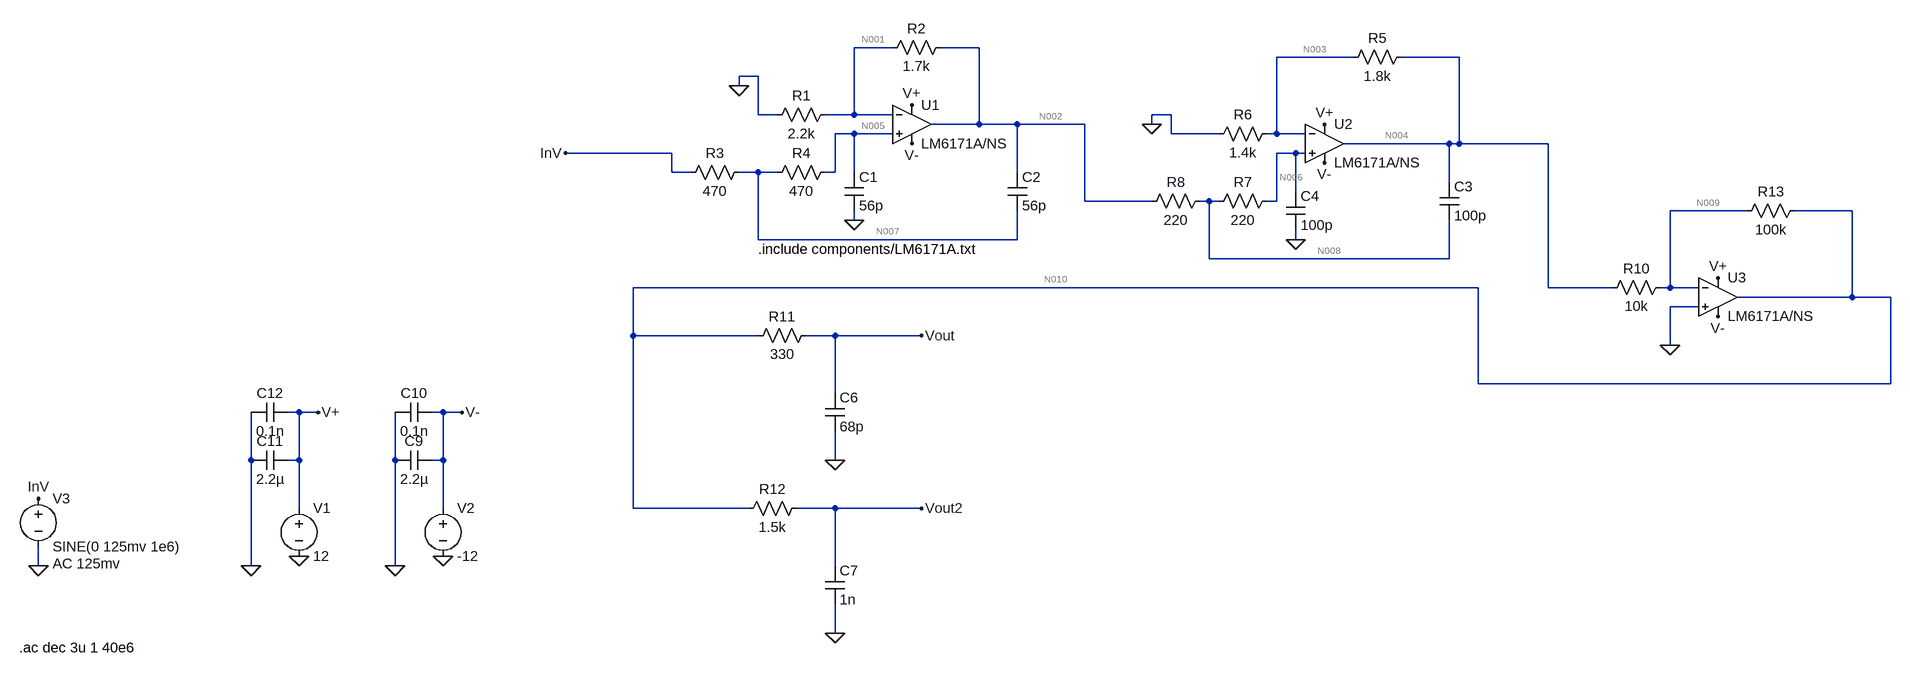
[diagram p0: schematic stage-4-LM318-sullen-key - only.asc]
stage-4-LM318-sullen-key - only.asc, the LTspice schematic file:
Version 4
SHEET 1 1972 1252
WIRE 176 32 112 32
WIRE 320 32 256 32
WIRE 944 48 816 48
WIRE 1120 48 1024 48
WIRE -48 80 -80 80
WIRE -80 96 -80 80
WIRE -48 144 -48 80
WIRE -16 144 -48 144
WIRE 112 144 112 32
WIRE 112 144 64 144
WIRE 176 144 112 144
WIRE 640 144 608 144
WIRE 320 160 320 32
WIRE 320 160 240 160
WIRE 384 160 320 160
WIRE 496 160 384 160
WIRE 608 160 608 144
WIRE 112 176 80 176
WIRE 176 176 112 176
WIRE 640 176 640 144
WIRE 720 176 640 176
WIRE 816 176 816 48
WIRE 816 176 800 176
WIRE 864 176 816 176
WIRE 1104 192 928 192
WIRE 1120 192 1120 48
WIRE 1120 192 1104 192
WIRE 1280 192 1120 192
WIRE -192 208 -464 208
WIRE 848 208 816 208
WIRE 864 208 848 208
WIRE -192 240 -192 208
WIRE -160 240 -192 240
WIRE -48 240 -80 240
WIRE -16 240 -48 240
WIRE 80 240 80 176
WIRE 80 240 64 240
WIRE 112 240 112 176
WIRE 384 240 384 160
WIRE 1104 256 1104 192
WIRE 848 272 848 208
WIRE 496 288 496 160
WIRE 608 288 496 288
WIRE 704 288 688 288
WIRE 720 288 704 288
WIRE 816 288 816 208
WIRE 816 288 800 288
WIRE 1648 304 1520 304
WIRE 1824 304 1728 304
WIRE 112 320 112 304
WIRE -48 352 -48 240
WIRE 384 352 384 304
WIRE 384 352 -48 352
WIRE 848 352 848 336
WIRE 704 384 704 288
WIRE 1104 384 1104 320
WIRE 1104 384 704 384
WIRE 1152 432 -256 432
WIRE 1280 432 1280 192
WIRE 1424 432 1280 432
WIRE 1520 432 1520 304
WIRE 1520 432 1504 432
WIRE 1568 432 1520 432
WIRE 1824 448 1824 304
WIRE 1824 448 1632 448
WIRE 1888 448 1824 448
WIRE 1568 464 1520 464
WIRE -256 512 -256 432
WIRE -48 512 -256 512
WIRE 80 512 32 512
WIRE 224 512 80 512
WIRE 1520 528 1520 464
WIRE 1152 592 1152 432
WIRE 1888 592 1888 448
WIRE 1888 592 1152 592
WIRE 80 608 80 512
WIRE -1040 640 -1056 640
WIRE -1008 640 -1040 640
WIRE -800 640 -816 640
WIRE -768 640 -800 640
WIRE -1120 720 -1120 640
WIRE -1040 720 -1040 640
WIRE -1040 720 -1056 720
WIRE -880 720 -880 640
WIRE -800 720 -800 640
WIRE -800 720 -816 720
WIRE 80 720 80 672
WIRE -1040 800 -1040 720
WIRE -800 800 -800 720
WIRE -256 800 -256 512
WIRE -64 800 -256 800
WIRE 80 800 16 800
WIRE 224 800 80 800
WIRE -1696 896 -1696 864
WIRE -1120 896 -1120 720
WIRE -880 896 -880 720
WIRE 80 896 80 800
WIRE 80 1008 80 960
FLAG 112 320 0
FLAG -80 96 0
FLAG 208 128 V+
FLAG 208 192 V-
FLAG -1040 880 0
FLAG -800 880 0
FLAG -1008 640 V+
FLAG -768 640 V-
FLAG 608 160 0
FLAG 848 352 0
FLAG 896 160 V+
FLAG 896 224 V-
FLAG 1600 416 V+
FLAG 1600 480 V-
FLAG 1520 528 0
FLAG 80 1008 0
FLAG 80 720 0
FLAG 224 512 Vout
FLAG 224 800 Vout2
FLAG -880 896 0
FLAG -1120 896 0
FLAG -464 208 InV
FLAG -1696 784 InV
FLAG -1696 896 0
SYMBOL OpAmps\\opamp2 208 96 R0
SYMATTR InstName U1
SYMATTR Value LM6171A/NS
SYMBOL res 80 128 R90
WINDOW 0 0 56 VBottom 2
WINDOW 3 32 56 VTop 2
SYMATTR InstName R1
SYMATTR Value 2.2k
SYMBOL res 272 16 R90
WINDOW 0 0 56 VBottom 2
WINDOW 3 32 56 VTop 2
SYMATTR InstName R2
SYMATTR Value 1.7k
SYMBOL res 80 224 R90
WINDOW 0 0 56 VBottom 2
WINDOW 3 32 56 VTop 2
SYMATTR InstName R4
SYMATTR Value 470
SYMBOL res -64 224 R90
WINDOW 0 0 56 VBottom 2
WINDOW 3 32 56 VTop 2
SYMATTR InstName R3
SYMATTR Value 470
SYMBOL cap 96 240 R0
SYMATTR InstName C1
SYMATTR Value 56p
SYMBOL cap 368 240 R0
SYMATTR InstName C2
SYMATTR Value 56p
SYMBOL voltage -1040 784 R0
WINDOW 123 0 0 Left 0
WINDOW 39 0 0 Left 0
SYMATTR InstName V1
SYMATTR Value 12
SYMBOL voltage -800 784 R0
WINDOW 123 0 0 Left 0
WINDOW 39 0 0 Left 0
SYMATTR InstName V2
SYMATTR Value -12
SYMBOL res 816 160 R90
WINDOW 0 0 56 VBottom 2
WINDOW 3 32 56 VTop 2
SYMATTR InstName R6
SYMATTR Value 1.4k
SYMBOL res 816 272 R90
WINDOW 0 0 56 VBottom 2
WINDOW 3 32 56 VTop 2
SYMATTR InstName R7
SYMATTR Value 220
SYMBOL res 704 272 R90
WINDOW 0 0 56 VBottom 2
WINDOW 3 32 56 VTop 2
SYMATTR InstName R8
SYMATTR Value 220
SYMBOL cap 832 272 R0
SYMATTR InstName C4
SYMATTR Value 100p
SYMBOL OpAmps\\opamp2 896 128 R0
SYMATTR InstName U2
SYMATTR Value LM6171A/NS
SYMBOL res 1040 32 R90
WINDOW 0 0 56 VBottom 2
WINDOW 3 32 56 VTop 2
SYMATTR InstName R5
SYMATTR Value 1.8k
SYMBOL cap 1088 256 R0
SYMATTR InstName C3
SYMATTR Value 100p
SYMBOL res 1520 416 R90
WINDOW 0 0 56 VBottom 2
WINDOW 3 32 56 VTop 2
SYMATTR InstName R10
SYMATTR Value 10k
SYMBOL OpAmps\\opamp2 1600 384 R0
SYMATTR InstName U3
SYMATTR Value LM6171A/NS
SYMBOL res 1744 288 R90
WINDOW 0 0 56 VBottom 2
WINDOW 3 32 56 VTop 2
SYMATTR InstName R13
SYMATTR Value 100k
SYMBOL res 48 496 R90
WINDOW 0 0 56 VBottom 2
WINDOW 3 32 56 VTop 2
SYMATTR InstName R11
SYMATTR Value 330
SYMBOL res 32 784 R90
WINDOW 0 0 56 VBottom 2
WINDOW 3 32 56 VTop 2
SYMATTR InstName R12
SYMATTR Value 1.5k
SYMBOL cap 64 608 R0
SYMATTR InstName C6
SYMATTR Value 68p
SYMBOL cap 64 896 R0
SYMATTR InstName C7
SYMATTR Value 1n
SYMBOL cap -816 704 R90
WINDOW 0 0 32 VBottom 2
WINDOW 3 32 32 VTop 2
SYMATTR InstName C9
SYMATTR Value 2.2µ
SYMBOL cap -816 624 R90
WINDOW 0 0 32 VBottom 2
WINDOW 3 32 32 VTop 2
SYMATTR InstName C10
SYMATTR Value 0.1n
SYMBOL cap -1056 704 R90
WINDOW 0 0 32 VBottom 2
WINDOW 3 32 32 VTop 2
SYMATTR InstName C11
SYMATTR Value 2.2µ
SYMBOL cap -1056 624 R90
WINDOW 0 0 32 VBottom 2
WINDOW 3 32 32 VTop 2
SYMATTR InstName C12
SYMATTR Value 0.1n
SYMBOL voltage -1696 768 R0
WINDOW 123 24 124 Left 2
WINDOW 39 0 0 Left 0
SYMATTR Value2 AC 125mv
SYMATTR InstName V3
SYMATTR Value SINE(0 125mv 1e6)
TEXT -48 368 Left 2 !.include components/LM6171A.txt
TEXT -1728 1032 Left 2 !.ac dec 3u 1 40e6

The netlist it stands for:
* stage-4-LM318-sullen-key - only.asc
XU1 N005 N001 V+ V- N002 LM6171A/NS  ; pins In+ In- V+ V- OUT
R1 N001 0 2.2k
R2 N002 N001 1.7k
R4 N005 N007 470
R3 N007 InV 470
C1 N005 0 56p
C2 N002 N007 56p
V1 V+ 0 12
V2 V- 0 -12
R6 N003 0 1.4k
R7 N006 N008 220
R8 N008 N002 220
C4 N006 0 100p
XU2 N006 N003 V+ V- N004 LM6171A/NS  ; pins In+ In- V+ V- OUT
R5 N004 N003 1.8k
C3 N004 N008 100p
R10 N009 N004 10k
XU3 0 N009 V+ V- N010 LM6171A/NS  ; pins In+ In- V+ V- OUT
R13 N010 N009 100k
R11 Vout N010 330
R12 Vout2 N010 1.5k
C6 Vout 0 68p
C7 Vout2 0 1n
C9 V- 0 2.2µ
C10 V- 0 0.1n
C11 V+ 0 2.2µ
C12 V+ 0 0.1n
V3 InV 0 SINE(0 125mv 1e6) AC 125mv
.include components/LM6171A.txt
.ac dec 3u 1 40e6
.backanno
.end

* Results of the author's LTspice run, read from the files saved beside the schematic
* Operating Point, zero values left out:
*   V(n001) = 2.029 mV
*   V(v-) = -12 V
*   V(n002) = 5.287 mV
*   V(n008) = 5.062 mV
*   V(n009) = 2.993 mV
*   V(n010) = -64.5 mV
*   V(vout2) = -64.5 mV
*   V(n005) = -961.5 µV
*   V(v+) = 12 V
*   V(n007) = -480.8 µV
*   V(n003) = 7.827 mV
*   V(n006) = 4.837 mV
*   V(n004) = 19.68 mV
*   V(vout) = -64.5 mV
*   I(R4) = -1.023 µA
*   I(R8) = -1.023 µA
*   I(R5) = 6.585 µA
*   I(R13) = -674.9 nA
*   I(V2) = 6.967 mA
*   I(R2) = 1.916 µA
*   I(R3) = -1.023 µA
*   I(V1) = -6.972 mA
*   I(R6) = 5.591 µA
*   I(R7) = -1.023 µA
*   I(R10) = -1.669 µA
*   I(R1) = 922.4 nA
*   I(V3) = -1.023 µA
*   Ix(u2:3) = 1.023 µA
*   Ix(u2:2) = 993.9 nA
*   Ix(u2:4) = 2.328 mA
*   Ix(u2:5) = -2.322 mA
*   Ix(u2:6) = -8.254 µA
*   Ix(u1:3) = 1.023 µA
*   Ix(u1:2) = 993.9 nA
*   Ix(u1:4) = 2.323 mA
*   Ix(u1:5) = -2.322 mA
*   Ix(u1:6) = -2.939 µA
*   Ix(u3:3) = 1.023 µA
*   Ix(u3:2) = 993.9 nA
*   Ix(u3:4) = 2.32 mA
*   Ix(u3:5) = -2.323 mA
*   Ix(u3:6) = 674.9 nA